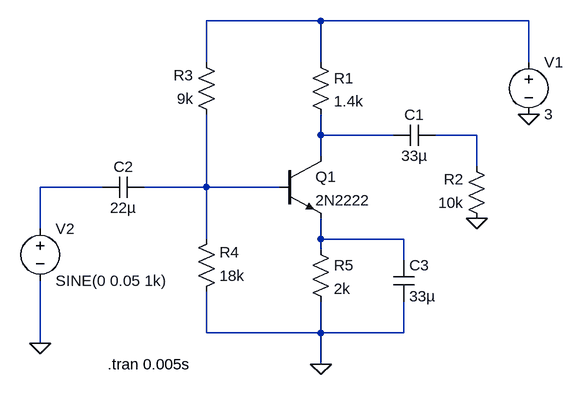
[diagram p0: schematic Pre-amplifier_OpAmp.asc]
Pre-amplifier_OpAmp.asc, the LTspice schematic file:
Version 4
SHEET 1 880 680
WIRE 128 -144 -48 -144
WIRE 448 -144 128 -144
WIRE -48 -80 -48 -144
WIRE 128 -80 128 -144
WIRE 448 -80 448 -144
WIRE 128 32 128 0
WIRE 240 32 128 32
WIRE 368 32 304 32
WIRE 128 64 128 32
WIRE 368 80 368 32
WIRE -208 112 -304 112
WIRE -48 112 -48 0
WIRE -48 112 -144 112
WIRE 64 112 -48 112
WIRE -304 176 -304 112
WIRE -48 192 -48 112
WIRE 128 192 128 160
WIRE 256 192 128 192
WIRE 128 208 128 192
WIRE 256 224 256 192
WIRE -48 336 -48 272
WIRE 128 336 128 288
WIRE 128 336 -48 336
WIRE 256 336 256 288
WIRE 256 336 128 336
WIRE -304 352 -304 256
WIRE 128 384 128 336
FLAG 128 384 0
FLAG -304 352 0
FLAG 448 0 0
FLAG 368 160 0
SYMBOL npn 64 64 R0
SYMATTR InstName Q1
SYMATTR Value 2N2222
SYMBOL res -32 16 R180
WINDOW 0 36 76 Left 2
WINDOW 3 36 40 Left 2
SYMATTR InstName R3
SYMATTR Value 9k
SYMBOL voltage 448 -96 R0
WINDOW 123 0 0 Left 0
WINDOW 39 0 0 Left 0
SYMATTR InstName V1
SYMATTR Value 3
SYMBOL voltage -304 160 R0
WINDOW 123 24 124 Left 2
WINDOW 39 0 0 Left 0
SYMATTR InstName V2
SYMATTR Value SINE(0 0.05 1k)
SYMBOL cap 304 16 R90
WINDOW 0 0 32 VBottom 2
WINDOW 3 32 32 VTop 2
SYMATTR InstName C1
SYMATTR Value 33µ
SYMBOL cap -208 128 R270
WINDOW 0 32 32 VTop 2
WINDOW 3 0 32 VBottom 2
SYMATTR InstName C2
SYMATTR Value 22µ
SYMBOL res 112 -96 R0
SYMATTR InstName R1
SYMATTR Value 1.4k
SYMBOL res 384 176 R180
WINDOW 0 36 76 Left 2
WINDOW 3 36 40 Left 2
SYMATTR InstName R2
SYMATTR Value 10k
SYMBOL res -64 288 M180
WINDOW 0 36 76 Left 2
WINDOW 3 36 40 Left 2
SYMATTR InstName R4
SYMATTR Value 18k
SYMBOL res 112 192 R0
SYMATTR InstName R5
SYMATTR Value 2k
SYMBOL cap 240 288 M180
WINDOW 0 24 56 Left 2
WINDOW 3 24 8 Left 2
SYMATTR InstName C3
SYMATTR Value 33µ
TEXT -200 384 Left 2 !.tran 0.005s

The netlist it stands for:
* Pre-amplifier_OpAmp.asc
Q1 N002 N005 N006 0 2N2222
R3 N005 N001 9k
V1 N001 0 3
V2 N004 0 SINE(0 0.05 1k)
C1 N003 N002 33µ
C2 N004 N005 22µ
R1 N001 N002 1.4k
R2 0 N003 10k
R4 0 N005 18k
R5 N006 0 2k
C3 0 N006 33µ
.model NPN NPN
.model PNP PNP
.lib standard.bjt
.tran 0.005s
.backanno
.end